# Altium schematic sheet Watchdog.SchDoc: EEROS: Adapter for NTB SCARA
size A4; DrawnBy: Martin Zueger; Organization: Interstate University of Applied; Address1: Werdenbergstrasse 4; Address3: 9470 Buchs; Address4: Switzerland; Revision: 0.1; SheetNumber: 3; SheetTotal: 3; Organization1: Sciences of Technology Buchs; ProjectName: EEROS
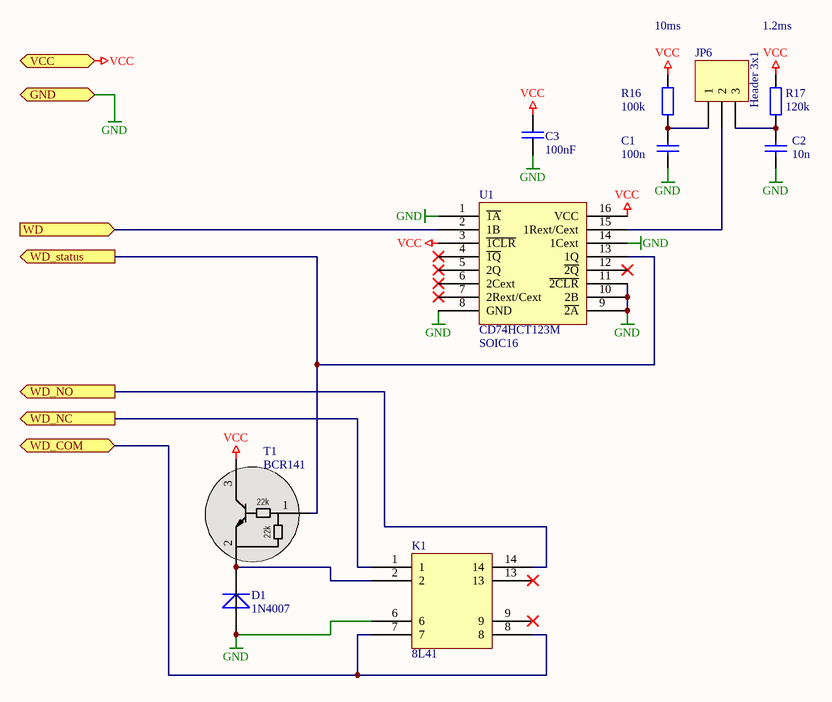
[diagram p0: Watchdog.SchDoc]

## Parts
C1  100n  [0805]
C2  10n  [0805]
C3  100nF  [1206]
D1  1N4007  [SMD-DO214AC]
JP6  Header 3x1  [Header - 1x3 - V]
K1  8L41  [8L41]
R16  100k  [0805]
R17  120k  [0805]
T1  BCR141  [SOT23-3Pin]
U1  Footprint: SOIC16  [SO16-W]  (hidden comment: CD74HCT123M)

## Ports
GND, VCC (in), WD (in), WD_COM, WD_NC (out), WD_NO (out), WD_status (out)

## Nets
GND: C1.1 C2.1 C3.1 D1.2(A) K1.6 U1.1(~{1A}) U1.8(GND) U1.9(~{2A}) U1.10(2B) U1.11(~{2CLR}) U1.14(1Cext) ; port GND
VCC: C3.2 R16.2 R17.2 T1.3(C) U1.3(~{1CLR}) U1.16(VCC) ; port VCC
WD: U1.2(1B) ; port WD
WD_COM: K1.7 K1.8 ; port WD_COM
WD_NC: K1.1 ; port WD_NC
WD_NO: K1.14 ; port WD_NO
WD_status: T1.1(B) U1.13(1Q) ; port WD_status
NetC1_2: C1.2 JP6.1 R16.1
NetC2_2: C2.2 JP6.3 R17.1
NetD1_1: D1.1(K) K1.2 T1.2(E)
NetJP6_2: JP6.2 U1.15(1Rext/Cext)

Not connected (* = marked no-connect by the designer): K1 9* 13*; U1 4(~{1Q})* 5(2Q)* 6(2Cext)* 7(2Rext/Cext)* 12(~{2Q})*

## Notes on the sheet
- 10ms
- 1.2ms
- Title:
- Description:
- Size:
- Date:
- Name:
- A4
- Number:
- Time:
- Revision:
- Sheet
- Checked:
- of
- File:
- (in symbol BCR141) 22k

## Library data of the parts
C1 C2 = C: Capacitor; #Manufacturer: Generic Components; #Publisher: Dr. A. Heinzelmann; #Class: Passive; Initial Voltage: 0V; #Published: 2006-10-07; #ClassSub: Capacitor; Voltage Maximum: *
  C1: Value: 100n
  C2: Value: 10n
C3 = C: Capacitor; #Manufacturer: Generic Components; #Publisher: Dr. A. Heinzelmann; #Class: Passive; Initial Voltage: 0V; Voltage Maximum: ??? V; #Published: 2006-10-07; #ClassSub: Capacitor; Value: 100nF
D1 = 1N4148: High Conductance Fast Diode; #Manufacturer: Generic Components; #Publisher: Dr. A. Heinzelmann; #Class: Discrete; #ClassSub: Diode - Switching; #Published: 2006-10-31; ComponentLink1Description: Datasheet; ComponentLink1URL: https://www.distrelec.com/distrelec/datasheets.nsf/WebAttachments/13CA773B80E18E83C125722E0045A8DA/$File/Diotec_Silizium-Dioden_bedrahtet_1N_4148_-_1N_4448_-_1N_4150..._Datasheet_DE_EN.pdf; ComponentLink2Description: Distributor; ComponentLink2URL: https://www.distrelec.ch/ishopWebFront/catalog/product.do/para/node/is/acaaaaaaaaaa/and/highlightNode/is/603016/and/id/is/01/and/series/is/1.html; Value: 1N4007
JP6 = Header 3: Header, 3-Pin; LatestRevisionDate: 17-Jul-2002; LatestRevisionNote: Re-released for DXP Platform.; Publisher: Altium Limited
K1 = 8L41: Reed Relais
R16 R17 = R: Resistor; #Manufacturer: Generic Components; #Publisher: Dr. A. Heinzelmann; #Class: Passive; #Published: 2006-10-06; #ClassSub: Resistor
  R16: Value: 100k
  R17: Value: 120k
T1 = BCR141: General Purpose NPN Transistor; Manufacturer: Infineon; Type: BCR141; Footprint: ???
U1 = CD74HCT123M: Multivibrator; Type: CD74HCT123M